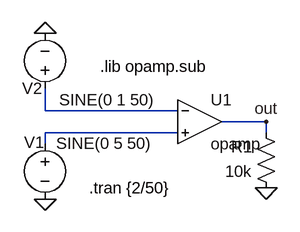
[diagram p0: schematic SIN TERMINAR Opamp xd lolllll.asc]
SIN TERMINAR Opamp xd lolllll.asc, the LTspice schematic file:
Version 4
SHEET 1 880 680
WIRE 112 176 112 144
WIRE 304 176 112 176
WIRE 432 192 368 192
WIRE 304 208 112 208
WIRE 432 208 432 192
WIRE 112 224 112 208
FLAG 112 304 0
FLAG 112 64 0
FLAG 432 288 0
FLAG 432 192 out
SYMBOL OpAmps\\opamp 336 128 R0
SYMATTR InstName U1
SYMATTR SpiceLine Aol=2
SYMBOL voltage 112 208 R0
WINDOW 123 0 0 Left 0
WINDOW 39 0 0 Left 0
WINDOW 0 -30 14 Left 2
WINDOW 3 16 15 Left 2
SYMATTR InstName V1
SYMATTR Value SINE(0 5 50)
SYMBOL voltage 112 160 R180
WINDOW 0 4 16 Left 2
WINDOW 3 -160 0 Left 2
WINDOW 123 0 0 Left 0
WINDOW 39 0 0 Left 0
SYMATTR InstName V2
SYMATTR Value SINE(0 1 50)
SYMBOL res 448 304 R180
WINDOW 0 36 76 Left 2
WINDOW 3 36 40 Left 2
SYMATTR InstName R1
SYMATTR Value 10k
TEXT 176 288 Left 2 !.tran {2/50}
TEXT 192 112 Left 2 !.lib opamp.sub

The netlist it stands for:
* SIN TERMINAR Opamp xd lolllll.asc
XU1 N001 N002 out opamp Aol=2 GBW=10Meg  ; pins invin noninvin out
V1 N002 0 SINE(0 5 50)
V2 N001 0 SINE(0 1 50)
R1 0 out 10k
.tran {2/50}
.lib opamp.sub
.backanno
.end